# Altium schematic sheet FPGA_IO.SchDoc
size A4; SheetNumber: 4; SheetTotal: 9
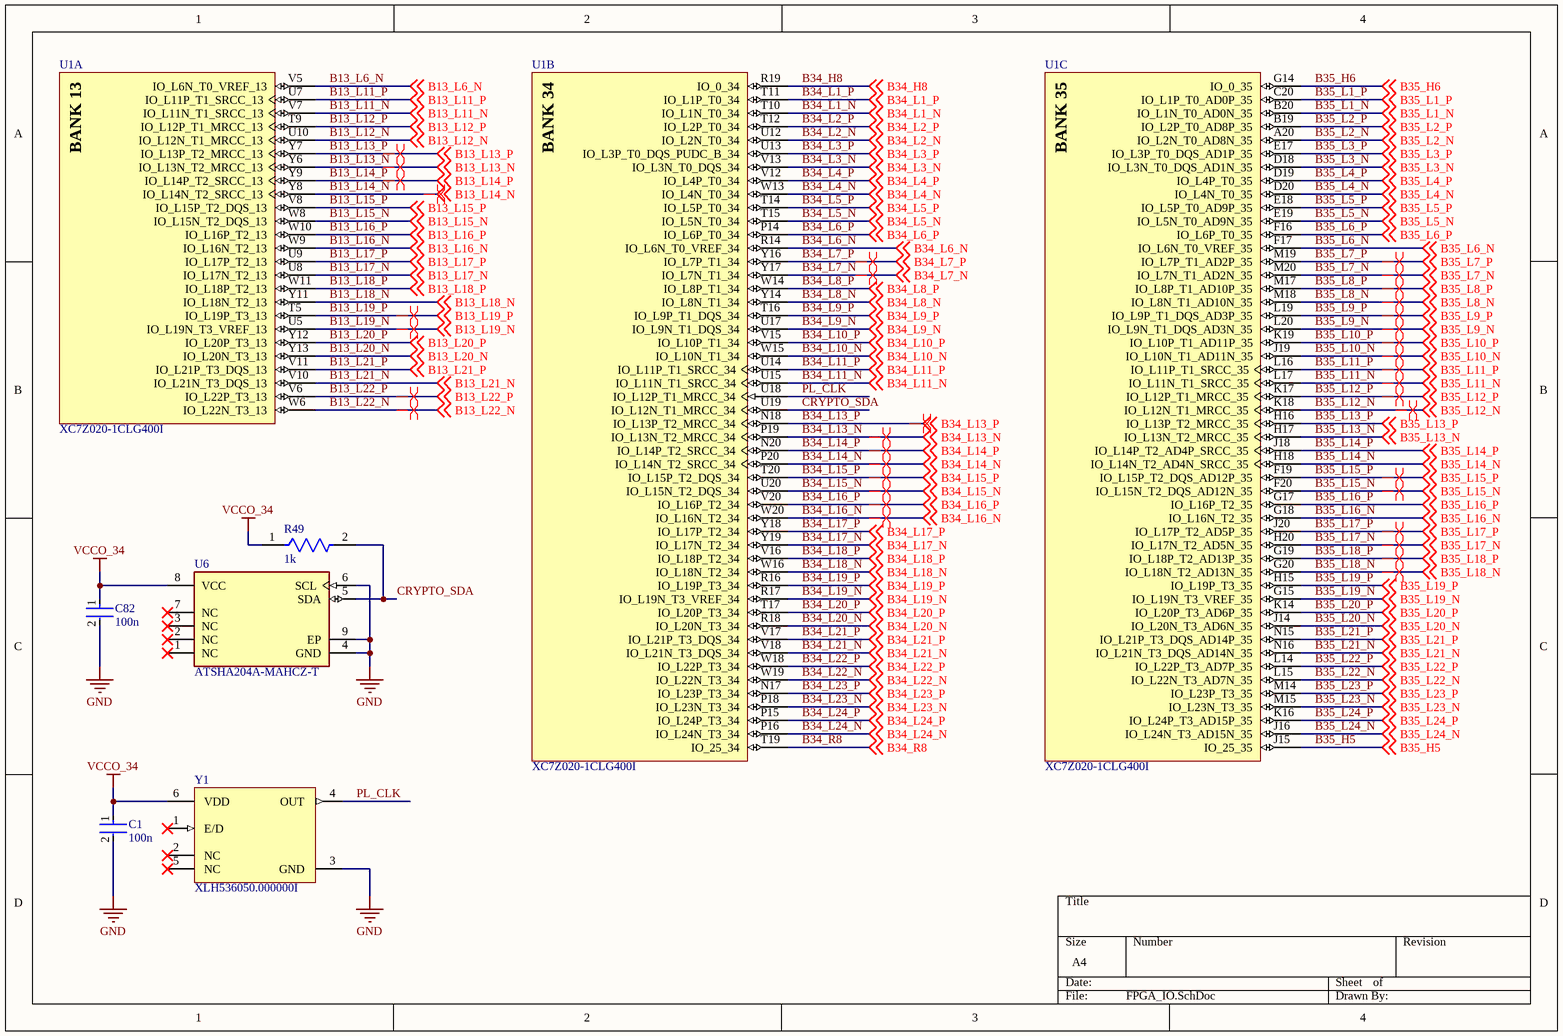
[diagram p0: FPGA_IO.SchDoc]

## Parts
C1  100n  [FP-CC0603-DA-MFG]
C82  100n  [FP-CC0603-DA-MFG]
R49  1k  [FP-RC0603-0_55-IPC_C]
U1  XC7Z020-1CLG400I  [CLG400]  (parts A,B,C of 9)
U6  ATSHA204A-MAHCZ-T  [FP-C04-21355-Q4B-MFG]
Y1  XLH536050.000000I  [JS6_MFG]

## Nets
GND: C1.2 C82.2 U6.4(GND) U6.6(SCL) U6.9(EP) Y1.3(GND)
VCCO_34: C1.1 C82.1 R49.1 U6.8(VCC) Y1.6(VDD)
B13_L6_N: U1.V5(IO_L6N_T0_VREF_13) ; off-sheet B13_L6_N
B13_L11_N: U1.V7(IO_L11N_T1_SRCC_13) ; off-sheet B13_L11_N
B13_L11_P: U1.U7(IO_L11P_T1_SRCC_13) ; off-sheet B13_L11_P
B13_L12_N: U1.U10(IO_L12N_T1_MRCC_13) ; off-sheet B13_L12_N
B13_L12_P: U1.T9(IO_L12P_T1_MRCC_13) ; off-sheet B13_L12_P
B13_L13_N: U1.Y6(IO_L13N_T2_MRCC_13) ; off-sheet B13_L13_N
B13_L13_P: U1.Y7(IO_L13P_T2_MRCC_13) ; off-sheet B13_L13_P
B13_L14_N: U1.Y8(IO_L14N_T2_SRCC_13) ; off-sheet B13_L14_N
B13_L14_P: U1.Y9(IO_L14P_T2_SRCC_13) ; off-sheet B13_L14_P
B13_L15_N: U1.W8(IO_L15N_T2_DQS_13) ; off-sheet B13_L15_N
B13_L15_P: U1.V8(IO_L15P_T2_DQS_13) ; off-sheet B13_L15_P
B13_L16_N: U1.W9(IO_L16N_T2_13) ; off-sheet B13_L16_N
B13_L16_P: U1.W10(IO_L16P_T2_13) ; off-sheet B13_L16_P
B13_L17_N: U1.U8(IO_L17N_T2_13) ; off-sheet B13_L17_N
B13_L17_P: U1.U9(IO_L17P_T2_13) ; off-sheet B13_L17_P
B13_L18_N: U1.Y11(IO_L18N_T2_13) ; off-sheet B13_L18_N
B13_L18_P: U1.W11(IO_L18P_T2_13) ; off-sheet B13_L18_P
B13_L19_N: U1.U5(IO_L19N_T3_VREF_13) ; off-sheet B13_L19_N
B13_L19_P: U1.T5(IO_L19P_T3_13) ; off-sheet B13_L19_P
B13_L20_N: U1.Y13(IO_L20N_T3_13) ; off-sheet B13_L20_N
B13_L20_P: U1.Y12(IO_L20P_T3_13) ; off-sheet B13_L20_P
B13_L21_N: U1.V10(IO_L21N_T3_DQS_13) ; off-sheet B13_L21_N
B13_L21_P: U1.V11(IO_L21P_T3_DQS_13) ; off-sheet B13_L21_P
B13_L22_N: U1.W6(IO_L22N_T3_13) ; off-sheet B13_L22_N
B13_L22_P: U1.V6(IO_L22P_T3_13) ; off-sheet B13_L22_P
B34_H8: U1.R19(IO_0_34) ; off-sheet B34_H8
B34_L1_N: U1.T10(IO_L1N_T0_34) ; off-sheet B34_L1_N
B34_L1_P: U1.T11(IO_L1P_T0_34) ; off-sheet B34_L1_P
B34_L2_N: U1.U12(IO_L2N_T0_34) ; off-sheet B34_L2_N
B34_L2_P: U1.T12(IO_L2P_T0_34) ; off-sheet B34_L2_P
B34_L3_N: U1.V13(IO_L3N_T0_DQS_34) ; off-sheet B34_L3_N
B34_L3_P: U1.U13(IO_L3P_T0_DQS_PUDC_B_34) ; off-sheet B34_L3_P
B34_L4_N: U1.W13(IO_L4N_T0_34) ; off-sheet B34_L4_N
B34_L4_P: U1.V12(IO_L4P_T0_34) ; off-sheet B34_L4_P
B34_L5_N: U1.T15(IO_L5N_T0_34) ; off-sheet B34_L5_N
B34_L5_P: U1.T14(IO_L5P_T0_34) ; off-sheet B34_L5_P
B34_L6_N: U1.R14(IO_L6N_T0_VREF_34) ; off-sheet B34_L6_N
B34_L6_P: U1.P14(IO_L6P_T0_34) ; off-sheet B34_L6_P
B34_L7_N: U1.Y17(IO_L7N_T1_34) ; off-sheet B34_L7_N
B34_L7_P: U1.Y16(IO_L7P_T1_34) ; off-sheet B34_L7_P
B34_L8_N: U1.Y14(IO_L8N_T1_34) ; off-sheet B34_L8_N
B34_L8_P: U1.W14(IO_L8P_T1_34) ; off-sheet B34_L8_P
B34_L9_N: U1.U17(IO_L9N_T1_DQS_34) ; off-sheet B34_L9_N
B34_L9_P: U1.T16(IO_L9P_T1_DQS_34) ; off-sheet B34_L9_P
B34_L10_N: U1.W15(IO_L10N_T1_34) ; off-sheet B34_L10_N
B34_L10_P: U1.V15(IO_L10P_T1_34) ; off-sheet B34_L10_P
B34_L11_N: U1.U15(IO_L11N_T1_SRCC_34) ; off-sheet B34_L11_N
B34_L11_P: U1.U14(IO_L11P_T1_SRCC_34) ; off-sheet B34_L11_P
B34_L13_N: U1.P19(IO_L13N_T2_MRCC_34) ; off-sheet B34_L13_N
B34_L13_P: U1.N18(IO_L13P_T2_MRCC_34) ; off-sheet B34_L13_P
B34_L14_N: U1.P20(IO_L14N_T2_SRCC_34) ; off-sheet B34_L14_N
B34_L14_P: U1.N20(IO_L14P_T2_SRCC_34) ; off-sheet B34_L14_P
B34_L15_N: U1.U20(IO_L15N_T2_DQS_34) ; off-sheet B34_L15_N
B34_L15_P: U1.T20(IO_L15P_T2_DQS_34) ; off-sheet B34_L15_P
B34_L16_N: U1.W20(IO_L16N_T2_34) ; off-sheet B34_L16_N
B34_L16_P: U1.V20(IO_L16P_T2_34) ; off-sheet B34_L16_P
B34_L17_N: U1.Y19(IO_L17N_T2_34) ; off-sheet B34_L17_N
B34_L17_P: U1.Y18(IO_L17P_T2_34) ; off-sheet B34_L17_P
B34_L18_N: U1.W16(IO_L18N_T2_34) ; off-sheet B34_L18_N
B34_L18_P: U1.V16(IO_L18P_T2_34) ; off-sheet B34_L18_P
B34_L19_N: U1.R17(IO_L19N_T3_VREF_34) ; off-sheet B34_L19_N
B34_L19_P: U1.R16(IO_L19P_T3_34) ; off-sheet B34_L19_P
B34_L20_N: U1.R18(IO_L20N_T3_34) ; off-sheet B34_L20_N
B34_L20_P: U1.T17(IO_L20P_T3_34) ; off-sheet B34_L20_P
B34_L21_N: U1.V18(IO_L21N_T3_DQS_34) ; off-sheet B34_L21_N
B34_L21_P: U1.V17(IO_L21P_T3_DQS_34) ; off-sheet B34_L21_P
B34_L22_N: U1.W19(IO_L22N_T3_34) ; off-sheet B34_L22_N
B34_L22_P: U1.W18(IO_L22P_T3_34) ; off-sheet B34_L22_P
B34_L23_N: U1.P18(IO_L23N_T3_34) ; off-sheet B34_L23_N
B34_L23_P: U1.N17(IO_L23P_T3_34) ; off-sheet B34_L23_P
B34_L24_N: U1.P16(IO_L24N_T3_34) ; off-sheet B34_L24_N
B34_L24_P: U1.P15(IO_L24P_T3_34) ; off-sheet B34_L24_P
B34_R8: U1.T19(IO_25_34) ; off-sheet B34_R8
B35_H5: U1.J15(IO_25_35) ; off-sheet B35_H5
B35_H6: U1.G14(IO_0_35) ; off-sheet B35_H6
B35_L1_N: U1.B20(IO_L1N_T0_AD0N_35) ; off-sheet B35_L1_N
B35_L1_P: U1.C20(IO_L1P_T0_AD0P_35) ; off-sheet B35_L1_P
B35_L2_N: U1.A20(IO_L2N_T0_AD8N_35) ; off-sheet B35_L2_N
B35_L2_P: U1.B19(IO_L2P_T0_AD8P_35) ; off-sheet B35_L2_P
B35_L3_N: U1.D18(IO_L3N_T0_DQS_AD1N_35) ; off-sheet B35_L3_N
B35_L3_P: U1.E17(IO_L3P_T0_DQS_AD1P_35) ; off-sheet B35_L3_P
B35_L4_N: U1.D20(IO_L4N_T0_35) ; off-sheet B35_L4_N
B35_L4_P: U1.D19(IO_L4P_T0_35) ; off-sheet B35_L4_P
B35_L5_N: U1.E19(IO_L5N_T0_AD9N_35) ; off-sheet B35_L5_N
B35_L5_P: U1.E18(IO_L5P_T0_AD9P_35) ; off-sheet B35_L5_P
B35_L6_N: U1.F17(IO_L6N_T0_VREF_35) ; off-sheet B35_L6_N
B35_L6_P: U1.F16(IO_L6P_T0_35) ; off-sheet B35_L6_P
B35_L7_N: U1.M20(IO_L7N_T1_AD2N_35) ; off-sheet B35_L7_N
B35_L7_P: U1.M19(IO_L7P_T1_AD2P_35) ; off-sheet B35_L7_P
B35_L8_N: U1.M18(IO_L8N_T1_AD10N_35) ; off-sheet B35_L8_N
B35_L8_P: U1.M17(IO_L8P_T1_AD10P_35) ; off-sheet B35_L8_P
B35_L9_N: U1.L20(IO_L9N_T1_DQS_AD3N_35) ; off-sheet B35_L9_N
B35_L9_P: U1.L19(IO_L9P_T1_DQS_AD3P_35) ; off-sheet B35_L9_P
B35_L10_N: U1.J19(IO_L10N_T1_AD11N_35) ; off-sheet B35_L10_N
B35_L10_P: U1.K19(IO_L10P_T1_AD11P_35) ; off-sheet B35_L10_P
B35_L11_N: U1.L17(IO_L11N_T1_SRCC_35) ; off-sheet B35_L11_N
B35_L11_P: U1.L16(IO_L11P_T1_SRCC_35) ; off-sheet B35_L11_P
B35_L12_N: U1.K18(IO_L12N_T1_MRCC_35) ; off-sheet B35_L12_N
B35_L12_P: U1.K17(IO_L12P_T1_MRCC_35) ; off-sheet B35_L12_P
B35_L13_N: U1.H17(IO_L13N_T2_MRCC_35) ; off-sheet B35_L13_N
B35_L13_P: U1.H16(IO_L13P_T2_MRCC_35) ; off-sheet B35_L13_P
B35_L14_N: U1.H18(IO_L14N_T2_AD4N_SRCC_35) ; off-sheet B35_L14_N
B35_L14_P: U1.J18(IO_L14P_T2_AD4P_SRCC_35) ; off-sheet B35_L14_P
B35_L15_N: U1.F20(IO_L15N_T2_DQS_AD12N_35) ; off-sheet B35_L15_N
B35_L15_P: U1.F19(IO_L15P_T2_DQS_AD12P_35) ; off-sheet B35_L15_P
B35_L16_N: U1.G18(IO_L16N_T2_35) ; off-sheet B35_L16_N
B35_L16_P: U1.G17(IO_L16P_T2_35) ; off-sheet B35_L16_P
B35_L17_N: U1.H20(IO_L17N_T2_AD5N_35) ; off-sheet B35_L17_N
B35_L17_P: U1.J20(IO_L17P_T2_AD5P_35) ; off-sheet B35_L17_P
B35_L18_N: U1.G20(IO_L18N_T2_AD13N_35) ; off-sheet B35_L18_N
B35_L18_P: U1.G19(IO_L18P_T2_AD13P_35) ; off-sheet B35_L18_P
B35_L19_N: U1.G15(IO_L19N_T3_VREF_35) ; off-sheet B35_L19_N
B35_L19_P: U1.H15(IO_L19P_T3_35) ; off-sheet B35_L19_P
B35_L20_N: U1.J14(IO_L20N_T3_AD6N_35) ; off-sheet B35_L20_N
B35_L20_P: U1.K14(IO_L20P_T3_AD6P_35) ; off-sheet B35_L20_P
B35_L21_N: U1.N16(IO_L21N_T3_DQS_AD14N_35) ; off-sheet B35_L21_N
B35_L21_P: U1.N15(IO_L21P_T3_DQS_AD14P_35) ; off-sheet B35_L21_P
B35_L22_N: U1.L15(IO_L22N_T3_AD7N_35) ; off-sheet B35_L22_N
B35_L22_P: U1.L14(IO_L22P_T3_AD7P_35) ; off-sheet B35_L22_P
B35_L23_N: U1.M15(IO_L23N_T3_35) ; off-sheet B35_L23_N
B35_L23_P: U1.M14(IO_L23P_T3_35) ; off-sheet B35_L23_P
B35_L24_N: U1.J16(IO_L24N_T3_AD15N_35) ; off-sheet B35_L24_N
B35_L24_P: U1.K16(IO_L24P_T3_AD15P_35) ; off-sheet B35_L24_P
CRYPTO_SDA: R49.2 U1.U19(IO_L12N_T1_MRCC_34) U6.5(SDA)
PL_CLK: U1.U18(IO_L12P_T1_MRCC_34) Y1.4(OUT)

Not connected (* = marked no-connect by the designer): U6 1(NC)* 2(NC)* 3(NC)* 7(NC)*; Y1 1(E/D)* 2(NC)* 5(NC)*

## Layout directives
differential pair: B13_L13_N, B13_L13_P, B13_L14_N, B13_L14_P, B13_L19_N, B13_L19_P, B13_L22_N, B13_L22_P, B34_L7_N, B34_L7_P, B34_L13_N, B34_L13_P, B34_L14_N, B34_L14_P, B34_L15_N, B34_L15_P, B34_L16_N, B34_L16_P, B35_L7_N, B35_L7_P, B35_L8_N, B35_L8_P, B35_L9_N, B35_L9_P, B35_L10_N, B35_L10_P, B35_L11_N, B35_L11_P, B35_L12_N, B35_L12_P, B35_L15_N, B35_L15_P, B35_L17_N, B35_L17_P, B35_L18_N, B35_L18_P

## Notes on the sheet
- (in symbol CMP-0363-00001-3, part A) BANK 13
- (in symbol CMP-0363-00001-3, part B) BANK 34
- (in symbol CMP-0363-00001-3, part C) BANK 35

## Library data of the parts
C1 C82 = CMP-2100-03601-2: CAP CER 0.1UF 50V X7R 0603; Manufacturer: YAGEO; Manufacturer Part Number: CC0603KRX7R9BB104; Material: Ceramic; Capacitance: 100 nF; Temperature Coefficient: 15%; Tolerance: 0.1; Value: 100 nF; Height: 0.9mm; Voltage: 50 V; ComponentLink2Description: Datasheet; Device Class L2: Capacitors; Temperature Range High: +125°C; Category: Cap; Footprint Url: http://www.yageo.com/exep/pages/download/literatures/UPY-C_GEN_24.pdf; ComponentLink2URL: http://www.yageo.com/documents/recent/UPY-GPHC_X7R_6.3V-to-50V_18.pdf; Package: CC0603-DA; Temperature: -55°C to +125°C; Voltage Rating: 50 V; Temperature Characteristic: X7R; Device Class L1: Passive Components; Temperature Range Low: -55°C; RoHS: TRUE; Automotive: No; Device Class L3: Ceramic Capacitors; Octopart: https://octopart.com/cc0603krx7r9bb104-yageo-42244635; Mouser Description: Multilayer Ceramic Capacitor, CC Series, 0.1 - F, - 10%, X7R, 50 V, 0603 [1608 Metric]; Lead Free: Yes; Digikey Description: CAP CER 0.1UF 50V X7R 0603
R49 = CMP-1659-00009-5: RES 1K OHM 1% 1/10W 0603; Resistance: 1kR; Voltage Rating: 50V; Power Rating: 100mW; Temperature Coefficient: 100ppm/°C; Military Standard: Not; REACH SVHC: No SVHC; Size Code: 0603; Features: Moisture Resistant; Number of Terminations: 2; Technology: THICK FILM; Series: RC; Case Code (Metric): 1608; Resistance Tolerance: 1%; Resistor Type: Thick Film; Termination: SMD/SMT; Contact Plating: Tin; Radiation Hardening: No; Min Operating Temperature: -55°C; Max Operating Temperature: 155°C; Packaging: Tape and Reel; Max Power Dissipation: 100mW; RoHS Compliant: Yes; Height: 0.45mm; Lead Free: Lead Free; Case/Package: 0603; Length: 1.6mm; Tolerance: 1%; Case Code (Imperial): 0603; Construction: Rectangular; Depth: 0.8mm
U1 = CMP-0363-00001-3: 667 MHz Zynq™-7000 AP SoC, 130 PS I/O, 125 FPGA I/O, 400-Ball BGA, Speed Grade 1, Industrial Grade, Pb-Free; LUTs: 53200; Flip Flops: 106400; Extensible Block RAM (# 36Kb Blocks): 560 KB (140); Speed Grade: -1; RoHS: Pb-Free; ComponentLink3Description: DC and AC Switching Characteristics; ComponentLink6Description: PCB and Layout Guide; ComponentLink1Description: Datasheet; ComponentLink4URL: http://www.xilinx.com/support/packagefiles/z7packages/xc7z020clg400pkg.txt; ComponentLink2Description: Package Specification; PackageReference: CLG400; ComponentLink4Description: Package File; Generic Part Number: XC7Z020; ComponentLink6URL: http://www.xilinx.com/support/documentation/user_guides/ug483_7Series_PCB.pdf; PackageVersion: Rev 1.1, 09/2012; PartNumber: XC7Z020-1CLG400I; PackageDescription: Wire-Bond Chip-Scale BGA, Body 17 x 17 mm, 0.8 mm Pitch; ComponentLink5Description: Packaging and Pinout; ComponentLink2URL: http://www.xilinx.com/support/documentation/user_guides/ug865-Zynq-7000-Pkg-Pinout.pdf; ComponentLink5URL: http://www.xilinx.com/support/documentation/user_guides/ug865-Zynq-7000-Pkg-Pinout.pdf; DatasheetVersion: v1.2; Code_JEDEC: MO-275-MMAA-1; Mounting Technology: Surface Mount; ComponentLink3URL: http://www.xilinx.com/support/documentation/data_sheets/ds187-XC7Z010-XC7Z020-Data-Sheet.pdf; ComponentLink1URL: http://www.xilinx.com/support/documentation/data_sheets/ds190-Zynq-7000-Overview.pdf
U6 = CMP-06272-000012-1: IC AUTHENTICATION CHIP 8UDFN; Data Bus Width: 72b; Operating Supply Voltage: 5.5V; Weight: 0.000335oz; RoHS Compliant: Yes; Number of Pins: 8; Package Quantity: 15000; Max Operating Temperature: 85°C; Mount: Surface Mount; Packaging: Cut Tape; Min Operating Temperature: -40°C
Y1 = CMP-00572-106940102-2: Oscillator Xo 50MHZ ±25PPM 15PF Hcmos 55% 3.3V 6-PIN Cllcc SMD T/r; Max Output Frequency: 99.9MHz; Output Type: LVCMOS; Max Input Voltage: 3.465V; Min Input Voltage: 3.135V; ComponentLink2Description: Datasheet URL; ComponentLink2URL: https://octopart.com/cad-content/api/get-model-datasheet/15189/106940102; ComponentLink3Description: Manufacturer's Package Drawing; RoHS: Compliant; ComponentLink3URL: https://www.renesas.com/en/document/psc/js6-package-outline-50-x-32-mm-body-11-mm-thick; ComponentLink1URL: http://www.renesas.com; Thickness: 1.1mm; Width: 3.2mm; Height: 1.2mm; Case/Package: CLCC; Length: 5mm; Lead Free: Lead Free; Number of Pins: 6; Mount: Surface Mount; ComponentLink1Description: Manufacturer's Website; HelpURL: https://octopart.com/cad-content/api/get-model-datasheet/15189/106940102; Max Operating Temperature: 85°C; Min Operating Temperature: -40°C